# EAGLE schematic source_selector (EAGLE 7.5.0)
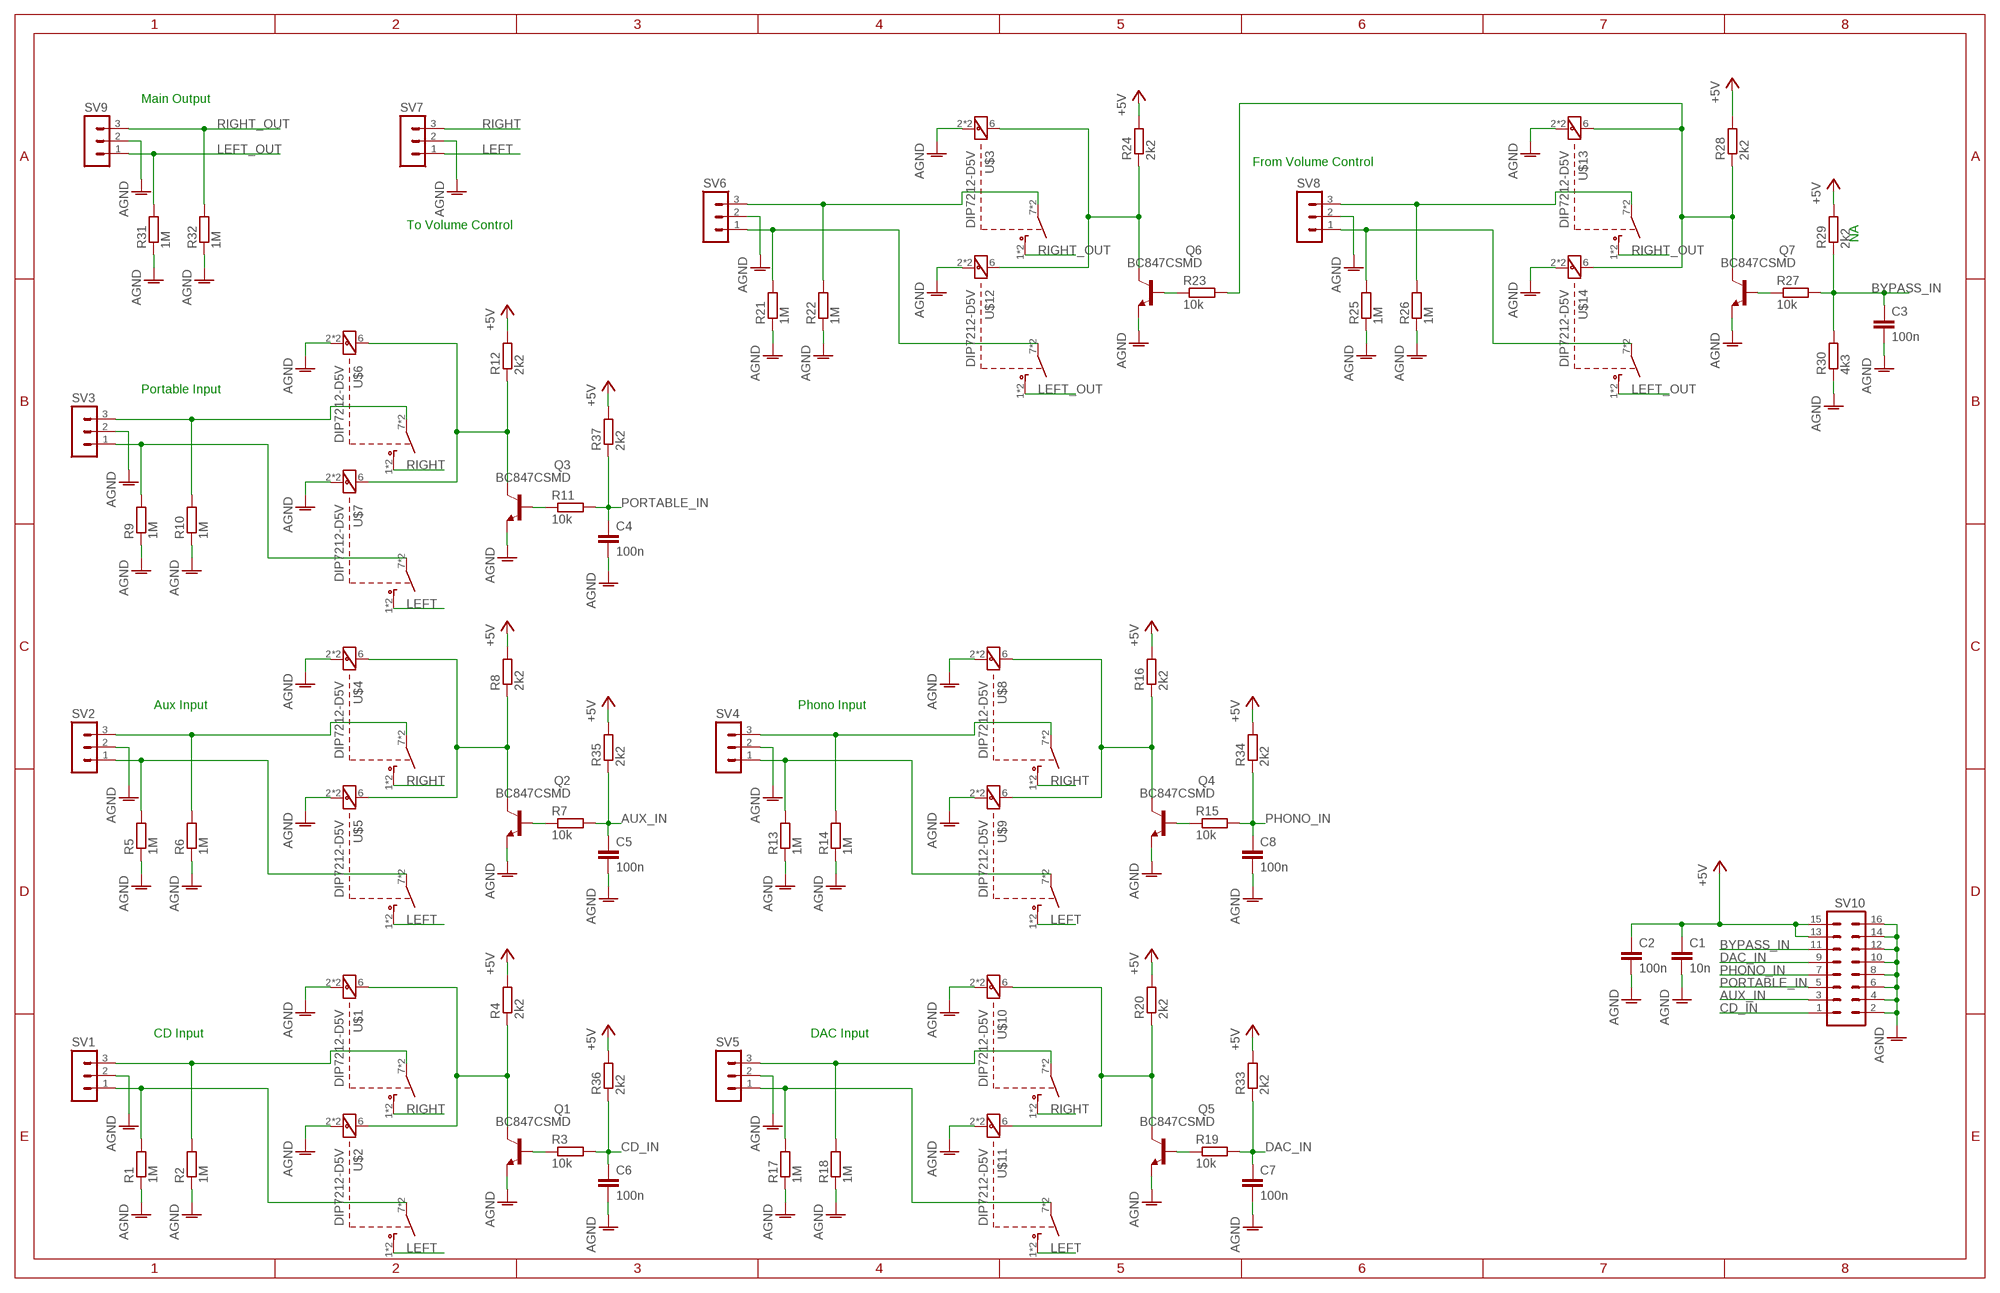
[diagram p0: schematic, sheet 1]

## Parts
C1  10n  C-EUC0603  [C0603]
C2  100n  C-EUC0603  [C0603]
C3  100n  C-EUC0603  [C0603]
C4  100n  C-EUC0603  [C0603]
C5  100n  C-EUC0603  [C0603]
C6  100n  C-EUC0603  [C0603]
C7  100n  C-EUC0603  [C0603]
C8  100n  C-EUC0603  [C0603]
Q1  BC847CSMD  [SOT23]
Q2  BC847CSMD  [SOT23]
Q3  BC847CSMD  [SOT23]
Q4  BC847CSMD  [SOT23]
Q5  BC847CSMD  [SOT23]
Q6  BC847CSMD  [SOT23]
Q7  BC847CSMD  [SOT23]
R1  1M  R-EU_R0603  [R0603]
R2  1M  R-EU_R0603  [R0603]
R3  10k  R-EU_R0603  [R0603]
R4  2k2  R-EU_R0603  [R0603]
R5  1M  R-EU_R0603  [R0603]
R6  1M  R-EU_R0603  [R0603]
R7  10k  R-EU_R0603  [R0603]
R8  2k2  R-EU_R0603  [R0603]
R9  1M  R-EU_R0603  [R0603]
R10  1M  R-EU_R0603  [R0603]
R11  10k  R-EU_R0603  [R0603]
R12  2k2  R-EU_R0603  [R0603]
R13  1M  R-EU_R0603  [R0603]
R14  1M  R-EU_R0603  [R0603]
R15  10k  R-EU_R0603  [R0603]
R16  2k2  R-EU_R0603  [R0603]
R17  1M  R-EU_R0603  [R0603]
R18  1M  R-EU_R0603  [R0603]
R19  10k  R-EU_R0603  [R0603]
R20  2k2  R-EU_R0603  [R0603]
R21  1M  R-EU_R0603  [R0603]
R22  1M  R-EU_R0603  [R0603]
R23  10k  R-EU_R0603  [R0603]
R24  2k2  R-EU_R0603  [R0603]
R25  1M  R-EU_R0603  [R0603]
R26  1M  R-EU_R0603  [R0603]
R27  10k  R-EU_R0603  [R0603]
R28  2k2  R-EU_R0603  [R0603]
R29  2k2  R-EU_R0603  [R0603]
R30  4k3  R-EU_R0603  [R0603]
R31  1M  R-EU_R0603  [R0603]
R32  1M  R-EU_R0603  [R0603]
R33  2k2  R-EU_R0603  [R0603]
R34  2k2  R-EU_R0603  [R0603]
R35  2k2  R-EU_R0603  [R0603]
R36  2k2  R-EU_R0603  [R0603]
R37  2k2  R-EU_R0603  [R0603]
SV1  MA03-1  [MA03-1]
SV2  MA03-1  [MA03-1]
SV3  MA03-1  [MA03-1]
SV4  MA03-1  [MA03-1]
SV5  MA03-1  [MA03-1]
SV6  MA03-1  [MA03-1]
SV7  MA03-1  [MA03-1]
SV8  MA03-1  [MA03-1]
SV9  MA03-1  [MA03-1]
SV10  MA08-2  [MA08-2]
U$1  DIP7212-D5V  [DP-07]
U$2  DIP7212-D5V  [DP-07]
U$3  DIP7212-D5V  [DP-07]
U$4  DIP7212-D5V  [DP-07]
U$5  DIP7212-D5V  [DP-07]
U$6  DIP7212-D5V  [DP-07]
U$7  DIP7212-D5V  [DP-07]
U$8  DIP7212-D5V  [DP-07]
U$9  DIP7212-D5V  [DP-07]
U$10  DIP7212-D5V  [DP-07]
U$11  DIP7212-D5V  [DP-07]
U$12  DIP7212-D5V  [DP-07]
U$13  DIP7212-D5V  [DP-07]
U$14  DIP7212-D5V  [DP-07]

## Nets
+5V: C1.1 C2.1 R4.2 R8.2 R12.2 R16.2 R20.2 R24.2 R28.2 R29.2 R33.2 R34.2 R35.2 R36.2 R37.2 SV10.13 SV10.15
AGND: C1.2 C2.2 C3.2 C4.2 C5.2 C6.2 C7.2 C8.2 Q1.2(E) Q2.2(E) Q3.2(E) Q4.2(E) Q5.2(E) Q6.2(E) Q7.2(E) R1.1 R2.1 R5.1 R6.1 R9.1 R10.1 R13.1 R14.1 R17.1 R18.1 R21.1 R22.1 R25.1 R26.1 R30.1 R31.1 R32.1 SV1.2 SV2.2 SV3.2 SV4.2 SV5.2 SV6.2 SV7.2 SV8.2 SV9.2 SV10.2 SV10.4 SV10.6 SV10.8 SV10.10 SV10.12 SV10.14 SV10.16 U$1.2 U$1.13 U$2.2 U$2.13 U$3.2 U$3.13 U$4.2 U$4.13 U$5.2 U$5.13 U$6.2 U$6.13 U$7.2 U$7.13 U$8.2 U$8.13 U$9.2 U$9.13 U$10.2 U$10.13 U$11.2 U$11.13 U$12.2 U$12.13 U$13.2 U$13.13 U$14.2 U$14.13
AUX_IN: C5.1 R7.2 R35.1 SV10.3
BYPASS_IN: C3.1 R27.2 R29.1 R30.2 SV10.11
CD_IN: C6.1 R3.2 R36.1 SV10.1
DAC_IN: C7.1 R19.2 R33.1 SV10.9
LEFT: SV7.1 U$2.1 U$2.14 U$5.1 U$5.14 U$7.1 U$7.14 U$9.1 U$9.14 U$11.1 U$11.14
LEFT_OUT: R31.2 SV9.1 U$12.1 U$12.14 U$14.1 U$14.14
N$1: R2.2 SV1.3 U$1.7 U$1.8
N$2: R1.2 SV1.1 U$2.7 U$2.8
N$3: Q1.1(B) R3.1
N$4: Q1.3(C) R4.1 U$1.6 U$2.6
N$5: R6.2 SV2.3 U$4.7 U$4.8
N$6: R5.2 SV2.1 U$5.7 U$5.8
N$7: Q2.1(B) R7.1
N$8: Q2.3(C) R8.1 U$4.6 U$5.6
N$9: R10.2 SV3.3 U$6.7 U$6.8
N$10: R9.2 SV3.1 U$7.7 U$7.8
N$11: Q3.1(B) R11.1
N$12: Q3.3(C) R12.1 U$6.6 U$7.6
N$13: R14.2 SV4.3 U$8.7 U$8.8
N$14: R13.2 SV4.1 U$9.7 U$9.8
N$15: Q4.1(B) R15.1
N$16: Q4.3(C) R16.1 U$8.6 U$9.6
N$17: R18.2 SV5.3 U$10.7 U$10.8
N$18: R17.2 SV5.1 U$11.7 U$11.8
N$19: Q5.1(B) R19.1
N$20: Q5.3(C) R20.1 U$10.6 U$11.6
N$21: R22.2 SV6.3 U$3.7 U$3.8
N$22: R21.2 SV6.1 U$12.7 U$12.8
N$23: Q6.1(B) R23.1
N$24: Q6.3(C) R24.1 U$3.6 U$12.6
N$25: R26.2 SV8.3 U$13.7 U$13.8
N$26: R25.2 SV8.1 U$14.7 U$14.8
N$27: Q7.1(B) R27.1
N$29: Q7.3(C) R23.2 R28.1 U$13.6 U$14.6
PHONO_IN: C8.1 R15.2 R34.1 SV10.7
PORTABLE_IN: C4.1 R11.2 R37.1 SV10.5
RIGHT: SV7.3 U$1.1 U$1.14 U$4.1 U$4.14 U$6.1 U$6.14 U$8.1 U$8.14 U$10.1 U$10.14
RIGHT_OUT: R32.2 SV9.3 U$3.1 U$3.14 U$13.1 U$13.14

## Notes on the sheet
- Main Output
- From Volume Control
- To Volume Control
- NA
- Portable Input
- Aux Input | Phono Input
- CD Input | DAC Input

## Library data of the parts
C1-C8 = rcl:C-EU: CAPACITOR, European symbol
Q1-Q7 = transistor-npn:BC847*: NPN Transistor
R1-R37 = rcl:R-EU_: RESISTOR, European symbol
SV1-SV9 = con-lstb:MA03-1: PIN HEADER; OC_FARNELL: unknown; OC_NEWARK: unknown
SV10 = con-lstb:MA08-2: PIN HEADER; OC_FARNELL: unknown; OC_NEWARK: unknown
U$1-U$14 = meder:DIP7212-D5V: Meder DIP 7212-D 5V Reedrelais, 5V, 1 Schließer mit Diode, 1A http://cdn-reichelt.de/documents/datenblatt/C300/DATASHEET_DIP_NEW.pdf